# EAGLE schematic Relays_Multiplexer (EAGLE 9.3.0)
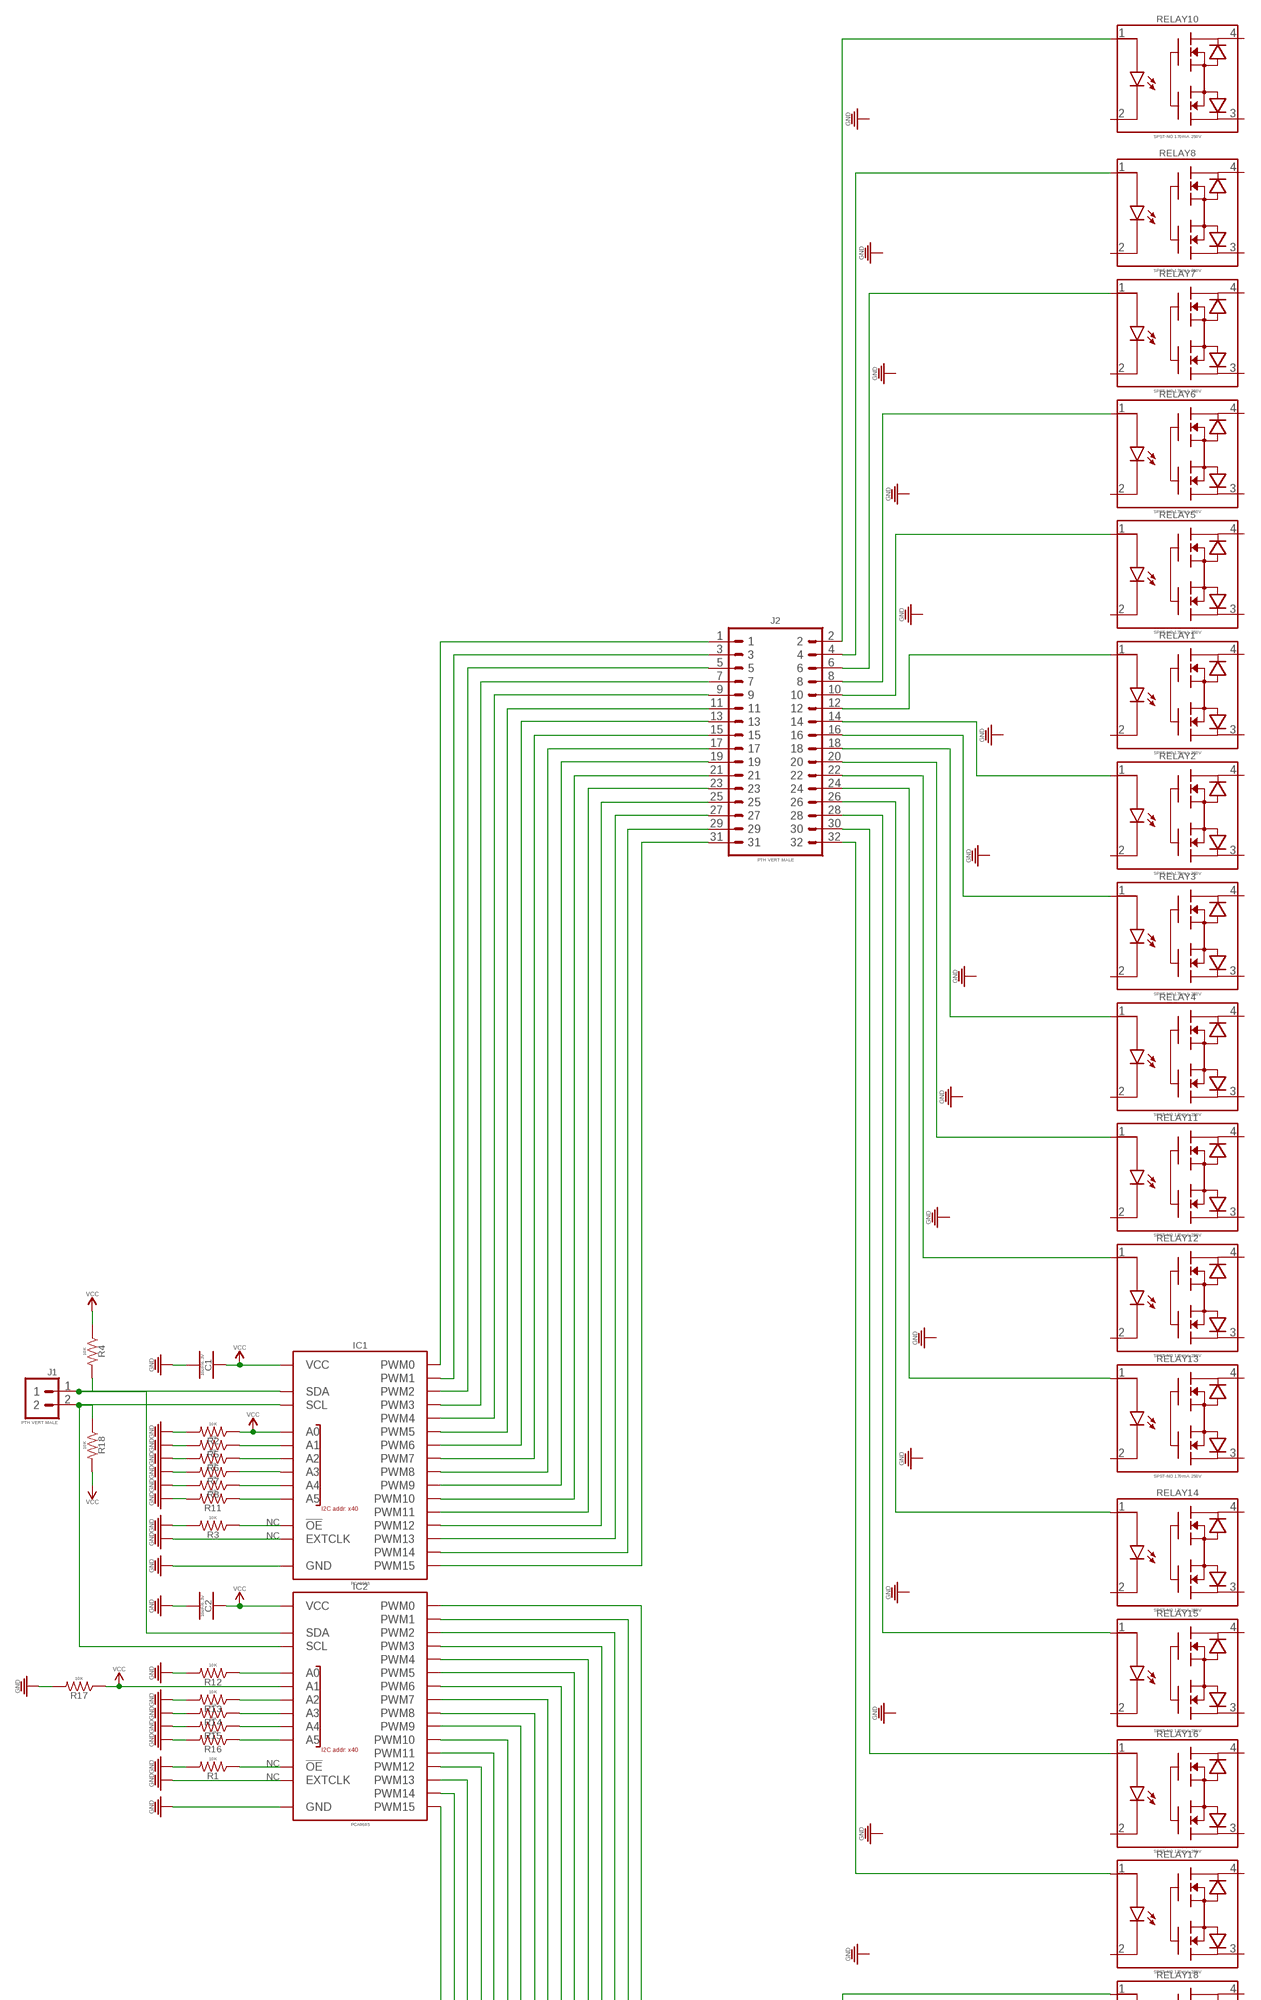
[diagram p0: schematic, sheet 1, part 1 of 2]
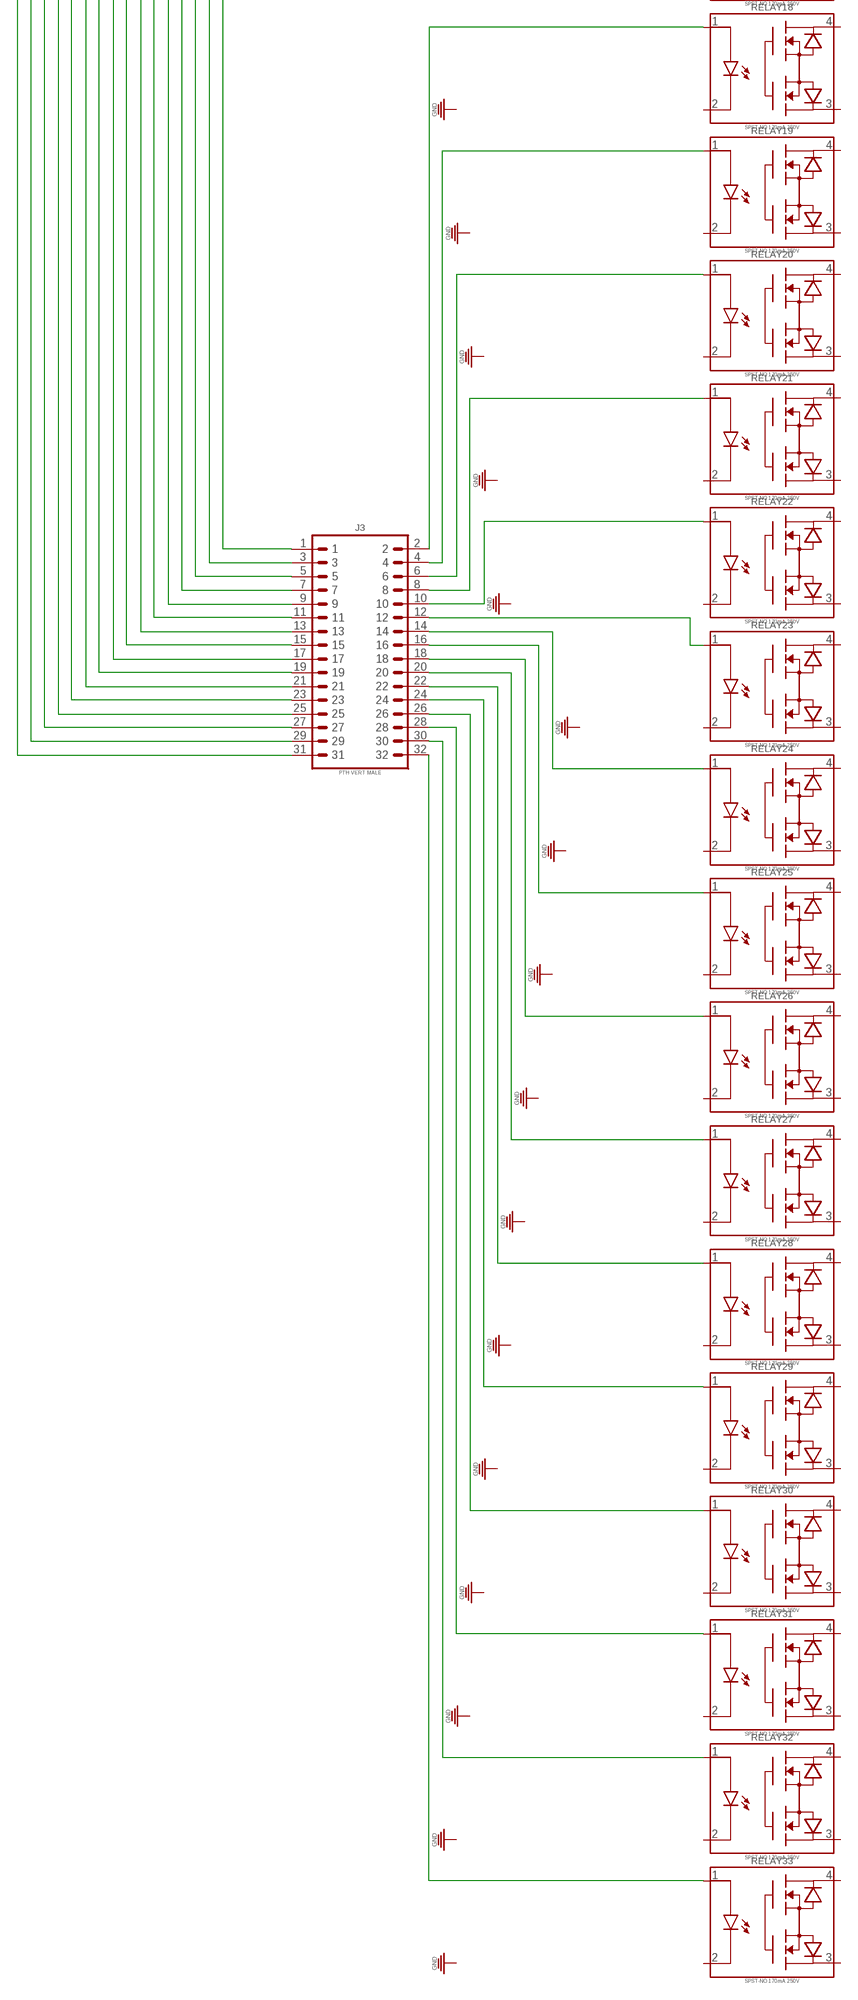
[diagram p1: schematic, sheet 1, part 2 of 2]

## Parts
C1  10uF/6.3V  10UF_CER_SMD-0402_6.3V-20%  [CAPC1005X55_SMD-0402]
C2  10uF/6.3V  10UF_CER_SMD-0402_6.3V-20%  [CAPC1005X55_SMD-0402]
IC1  PCA9685  PCA9685_16-CH_12-BIT_PWM-DRIVER_TSSOP-28_PWM-DRIVER_16CH  [SOP65P650X110-28]
IC2  PCA9685  PCA9685_16-CH_12-BIT_PWM-DRIVER_TSSOP-28_PWM-DRIVER_16CH  [SOP65P650X110-28]
J1  PTH VERT MALE  1X02_PTH_VERT_MALE_2.54MM  [HDRV2W64P254_1X2_508X254X838B]
J2  PTH VERT MALE  2X16_PTH_VERT_MALE_2.54MM  [HDRV32W64P254_2X16_4064X508X838B]
J3  PTH VERT MALE  2X16_PTH_VERT_MALE_2.54MM  [HDRV32W64P254_2X16_4064X508X838B]
R1  10K  10KΩ_SMD-0402_1/16W-5%  [RESC1005X35_SMD-0402]
R2  10K  10KΩ_SMD-0402_1/16W-5%  [RESC1005X35_SMD-0402]
R3  10K  10KΩ_SMD-0402_1/16W-5%  [RESC1005X35_SMD-0402]
R4  10K  10KΩ_SMD-0402_1/16W-5%  [RESC1005X35_SMD-0402]
R5  10K  10KΩ_SMD-0402_1/16W-5%  [RESC1005X35_SMD-0402]
R6  10K  10KΩ_SMD-0402_1/16W-5%  [RESC1005X35_SMD-0402]
R7  10K  10KΩ_SMD-0402_1/16W-5%  [RESC1005X35_SMD-0402]
R8  10K  10KΩ_SMD-0402_1/16W-5%  [RESC1005X35_SMD-0402]
R11  10K  10KΩ_SMD-0402_1/16W-5%  [RESC1005X35_SMD-0402]
R12  10K  10KΩ_SMD-0402_1/16W-5%  [RESC1005X35_SMD-0402]
R13  10K  10KΩ_SMD-0402_1/16W-5%  [RESC1005X35_SMD-0402]
R14  10K  10KΩ_SMD-0402_1/16W-5%  [RESC1005X35_SMD-0402]
R15  10K  10KΩ_SMD-0402_1/16W-5%  [RESC1005X35_SMD-0402]
R16  10K  10KΩ_SMD-0402_1/16W-5%  [RESC1005X35_SMD-0402]
R17  10K  10KΩ_SMD-0402_1/16W-5%  [RESC1005X35_SMD-0402]
R18  10K  10KΩ_SMD-0402_1/16W-5%  [RESC1005X35_SMD-0402]
RELAY1  SPST-NO 170mA 250V  RELAY_SOLID-STATE_SSR_170MA_250V_SPST-NO  [SOP254P609X203-4]
RELAY2  SPST-NO 170mA 250V  RELAY_SOLID-STATE_SSR_170MA_250V_SPST-NO  [SOP254P609X203-4]
RELAY3  SPST-NO 170mA 250V  RELAY_SOLID-STATE_SSR_170MA_250V_SPST-NO  [SOP254P609X203-4]
RELAY4  SPST-NO 170mA 250V  RELAY_SOLID-STATE_SSR_170MA_250V_SPST-NO  [SOP254P609X203-4]
RELAY5  SPST-NO 170mA 250V  RELAY_SOLID-STATE_SSR_170MA_250V_SPST-NO  [SOP254P609X203-4]
RELAY6  SPST-NO 170mA 250V  RELAY_SOLID-STATE_SSR_170MA_250V_SPST-NO  [SOP254P609X203-4]
RELAY7  SPST-NO 170mA 250V  RELAY_SOLID-STATE_SSR_170MA_250V_SPST-NO  [SOP254P609X203-4]
RELAY8  SPST-NO 170mA 250V  RELAY_SOLID-STATE_SSR_170MA_250V_SPST-NO  [SOP254P609X203-4]
RELAY10  SPST-NO 170mA 250V  RELAY_SOLID-STATE_SSR_170MA_250V_SPST-NO  [SOP254P609X203-4]
RELAY11  SPST-NO 170mA 250V  RELAY_SOLID-STATE_SSR_170MA_250V_SPST-NO  [SOP254P609X203-4]
RELAY12  SPST-NO 170mA 250V  RELAY_SOLID-STATE_SSR_170MA_250V_SPST-NO  [SOP254P609X203-4]
RELAY13  SPST-NO 170mA 250V  RELAY_SOLID-STATE_SSR_170MA_250V_SPST-NO  [SOP254P609X203-4]
RELAY14  SPST-NO 170mA 250V  RELAY_SOLID-STATE_SSR_170MA_250V_SPST-NO  [SOP254P609X203-4]
RELAY15  SPST-NO 170mA 250V  RELAY_SOLID-STATE_SSR_170MA_250V_SPST-NO  [SOP254P609X203-4]
RELAY16  SPST-NO 170mA 250V  RELAY_SOLID-STATE_SSR_170MA_250V_SPST-NO  [SOP254P609X203-4]
RELAY17  SPST-NO 170mA 250V  RELAY_SOLID-STATE_SSR_170MA_250V_SPST-NO  [SOP254P609X203-4]
RELAY18  SPST-NO 170mA 250V  RELAY_SOLID-STATE_SSR_170MA_250V_SPST-NO  [SOP254P609X203-4]
RELAY19  SPST-NO 170mA 250V  RELAY_SOLID-STATE_SSR_170MA_250V_SPST-NO  [SOP254P609X203-4]
RELAY20  SPST-NO 170mA 250V  RELAY_SOLID-STATE_SSR_170MA_250V_SPST-NO  [SOP254P609X203-4]
RELAY21  SPST-NO 170mA 250V  RELAY_SOLID-STATE_SSR_170MA_250V_SPST-NO  [SOP254P609X203-4]
RELAY22  SPST-NO 170mA 250V  RELAY_SOLID-STATE_SSR_170MA_250V_SPST-NO  [SOP254P609X203-4]
RELAY23  SPST-NO 170mA 250V  RELAY_SOLID-STATE_SSR_170MA_250V_SPST-NO  [SOP254P609X203-4]
RELAY24  SPST-NO 170mA 250V  RELAY_SOLID-STATE_SSR_170MA_250V_SPST-NO  [SOP254P609X203-4]
RELAY25  SPST-NO 170mA 250V  RELAY_SOLID-STATE_SSR_170MA_250V_SPST-NO  [SOP254P609X203-4]
RELAY26  SPST-NO 170mA 250V  RELAY_SOLID-STATE_SSR_170MA_250V_SPST-NO  [SOP254P609X203-4]
RELAY27  SPST-NO 170mA 250V  RELAY_SOLID-STATE_SSR_170MA_250V_SPST-NO  [SOP254P609X203-4]
RELAY28  SPST-NO 170mA 250V  RELAY_SOLID-STATE_SSR_170MA_250V_SPST-NO  [SOP254P609X203-4]
RELAY29  SPST-NO 170mA 250V  RELAY_SOLID-STATE_SSR_170MA_250V_SPST-NO  [SOP254P609X203-4]
RELAY30  SPST-NO 170mA 250V  RELAY_SOLID-STATE_SSR_170MA_250V_SPST-NO  [SOP254P609X203-4]
RELAY31  SPST-NO 170mA 250V  RELAY_SOLID-STATE_SSR_170MA_250V_SPST-NO  [SOP254P609X203-4]
RELAY32  SPST-NO 170mA 250V  RELAY_SOLID-STATE_SSR_170MA_250V_SPST-NO  [SOP254P609X203-4]
RELAY33  SPST-NO 170mA 250V  RELAY_SOLID-STATE_SSR_170MA_250V_SPST-NO  [SOP254P609X203-4]

## Nets
GND: C1.2 C2.2 IC1.14(GND) IC1.25(EXTCLK) IC2.14(GND) IC2.25(EXTCLK) R1.2 R2.2 R3.2 R5.2 R6.2 R7.2 R8.2 R11.2 R12.2 R13.2 R14.2 R15.2 R16.2 R17.2
N$1: IC1.23(!OE) R3.1
N$2: IC1.4(A3) R7.1
N$3: IC1.24(A5) R11.1
N$4: IC1.5(A4) R8.1
N$5: IC1.3(A2) R6.1
N$6: IC1.2(A1) R5.1
N$7: IC2.1(A0) R12.1
N$8: IC2.3(A2) R13.1
N$9: IC2.4(A3) R14.1
N$10: IC2.5(A4) R15.1
N$11: IC2.24(A5) R16.1
N$12: IC2.23(!OE) R1.1
N$13: IC1.27(SDA) IC2.27(SDA) J1.1 R4.2
N$14: IC1.26(SCL) IC2.26(SCL) J1.2 R18.1
N$15: J2.2 RELAY10.1
N$16: J2.4 RELAY8.1
N$17: J2.6 RELAY7.1
N$18: J2.8 RELAY6.1
N$19: J2.10 RELAY5.1
N$20: J2.12 RELAY1.1
N$21: J2.14 RELAY2.1
N$22: J2.16 RELAY3.1
N$23: J2.18 RELAY4.1
N$24: J2.20 RELAY11.1
N$25: J2.22 RELAY12.1
N$26: J2.24 RELAY13.1
N$27: J2.26 RELAY14.1
N$28: J2.28 RELAY15.1
N$29: J2.30 RELAY16.1
N$30: J2.32 RELAY17.1
N$31: J3.2 RELAY18.1
N$32: J3.4 RELAY19.1
N$33: J3.6 RELAY20.1
N$34: J3.8 RELAY21.1
N$35: J3.10 RELAY22.1
N$36: J3.12 RELAY23.1
N$37: J3.14 RELAY24.1
N$38: J3.16 RELAY25.1
N$39: J3.18 RELAY26.1
N$40: J3.20 RELAY27.1
N$41: J3.22 RELAY28.1
N$42: J3.24 RELAY29.1
N$43: J3.26 RELAY30.1
N$44: J3.28 RELAY31.1
N$45: J3.30 RELAY32.1
N$46: J3.32 RELAY33.1
N$47: IC1.6(PWM0) J2.1
N$48: IC1.7(PWM1) J2.3
N$49: IC1.8(PWM2) J2.5
N$50: IC1.9(PWM3) J2.7
N$51: IC1.10(PWM4) J2.9
N$52: IC1.11(PWM5) J2.11
N$53: IC1.12(PWM6) J2.13
N$54: IC1.13(PWM7) J2.15
N$55: IC1.15(PWM8) J2.17
N$56: IC1.16(PWM9) J2.19
N$57: IC1.17(PWM10) J2.21
N$58: IC1.18(PWM11) J2.23
N$59: IC1.19(PWM12) J2.25
N$60: IC1.20(PWM13) J2.27
N$61: IC1.21(PWM14) J2.29
N$62: IC1.22(PWM15) J2.31
N$63: IC2.22(PWM15) J3.31
N$64: IC2.21(PWM14) J3.29
N$65: IC2.20(PWM13) J3.27
N$66: IC2.19(PWM12) J3.25
N$67: IC2.18(PWM11) J3.23
N$68: IC2.17(PWM10) J3.21
N$69: IC2.16(PWM9) J3.19
N$70: IC2.15(PWM8) J3.17
N$71: IC2.13(PWM7) J3.15
N$72: IC2.12(PWM6) J3.13
N$73: IC2.11(PWM5) J3.11
N$74: IC2.10(PWM4) J3.9
N$75: IC2.9(PWM3) J3.7
N$76: IC2.8(PWM2) J3.5
N$77: IC2.7(PWM1) J3.3
N$78: IC2.6(PWM0) J3.1
VCC: C1.1 C2.1 IC1.1(A0) IC1.28(VCC) IC2.2(A1) IC2.28(VCC) R2.1 R4.1 R17.1 R18.2
Unconnected: RELAY1.2 RELAY1.3 RELAY1.4 RELAY2.2 RELAY2.3 RELAY2.4 RELAY3.2 RELAY3.3 RELAY3.4 RELAY4.2 RELAY4.3 RELAY4.4 RELAY5.2 RELAY5.3 RELAY5.4 RELAY6.2 RELAY6.3 RELAY6.4 RELAY7.2 RELAY7.3 RELAY7.4 RELAY8.2 RELAY8.3 RELAY8.4 RELAY10.2 RELAY10.3 RELAY10.4 RELAY11.2 RELAY11.3 RELAY11.4 RELAY12.2 RELAY12.3 RELAY12.4 RELAY13.2 RELAY13.3 RELAY13.4 RELAY14.2 RELAY14.3 RELAY14.4 RELAY15.2 RELAY15.3 RELAY15.4 RELAY16.2 RELAY16.3 RELAY16.4 RELAY17.2 RELAY17.3 RELAY17.4 RELAY18.2 RELAY18.3 RELAY18.4 RELAY19.2 RELAY19.3 RELAY19.4 RELAY20.2 RELAY20.3 RELAY20.4 RELAY21.2 RELAY21.3 RELAY21.4 RELAY22.2 RELAY22.3 RELAY22.4 RELAY23.2 RELAY23.3 RELAY23.4 RELAY24.2 RELAY24.3 RELAY24.4 RELAY25.2 RELAY25.3 RELAY25.4 RELAY26.2 RELAY26.3 RELAY26.4 RELAY27.2 RELAY27.3 RELAY27.4 RELAY28.2 RELAY28.3 RELAY28.4 RELAY29.2 RELAY29.3 RELAY29.4 RELAY30.2 RELAY30.3 RELAY30.4 RELAY31.2 RELAY31.3 RELAY31.4 RELAY32.2 RELAY32.3 RELAY32.4 RELAY33.2 RELAY33.3 RELAY33.4

## Library data of the parts
C1 C2 = _capacitors:10UF; DATASHEET: https://www.murata.com/~/media/webrenewal/support/library/catalog/products/capacitor/mlcc/c02e.ashx; DIST: Digikey; DISTLINK: https://www.digikey.com/products/en?keywords=490-13233-1-ND; DISTPN: 490-13233-1-ND; MFR: Murata Electronics North America; MPN: GRM155C80J106ME11D
IC1 IC2 = _special:PCA9685_16-CH_12-BIT_PWM-DRIVER; DATASHEET: https://www.nxp.com/docs/en/data-sheet/PCA9685.pdf; DIST: Digikey; DISTLINK: https://www.digikey.com/products/en?keywords=568-11925-1-ND; DISTPN: 568-11925-1-ND; MFR: NXP USA Inc.; MPN: PCA9685PW,118
J1 = _connectors:1X02: 2 Positions Header Connector 0.079" (2.00mm) Through Hole Tin; DATASHEET: https://drawings-pdf.s3.amazonaws.com/C10436.pdf; DIST: Digikey; DISTLINK: https://www.digikey.com/products/en?keywords=S1012E-02-ND; DISTPN: S1012E-02-ND; MFR: Sullins Connector Solutions; MPN: PEC02SAAN
J2 J3 = _connectors:2X16; DATASHEET: https://drawings-pdf.s3.amazonaws.com/C10419.pdf; DIST: Digikey; DISTLINK: https://www.digikey.com/products/en?keywords=S2012E-16-ND; DISTPN: S2012E-16-ND; MFR: Sullins Connector Solutions; MPN: PEC16DAAN
R1-R8 R11-R18 = _resistors:10KΩ; DATASHEET: http://www.yageo.com/NewPortal/yageodocoutput?fileName=/pdf/R-Chip/PYu-RC_51_RoHS_P_0.pdf; DIST: Digikey; DISTLINK: https://www.digikey.com/products/en?keywords=YAG1281CT-ND; DISTPN: YAG1281CT-ND; MFR: Yageo; MPN: RC0402JR-0710KP
RELAY1-RELAY8 RELAY10-RELAY33 = _relay:RELAY_SOLID-STATE; DATASHEET: http://www.ixysic.com/home/pdfs.nsf/www/CPC1010N.pdf/$file/CPC1010N.pdf; DIST: Digikey; DISTLINK: https://www.digikey.com/products/en?keywords=CPC1010N-ND; DISTPN: CPC1010N-ND; MFR: IXYS Integrated Circuits Division; MPN: CPC1010N